# EasyEDA schematic PCB.json
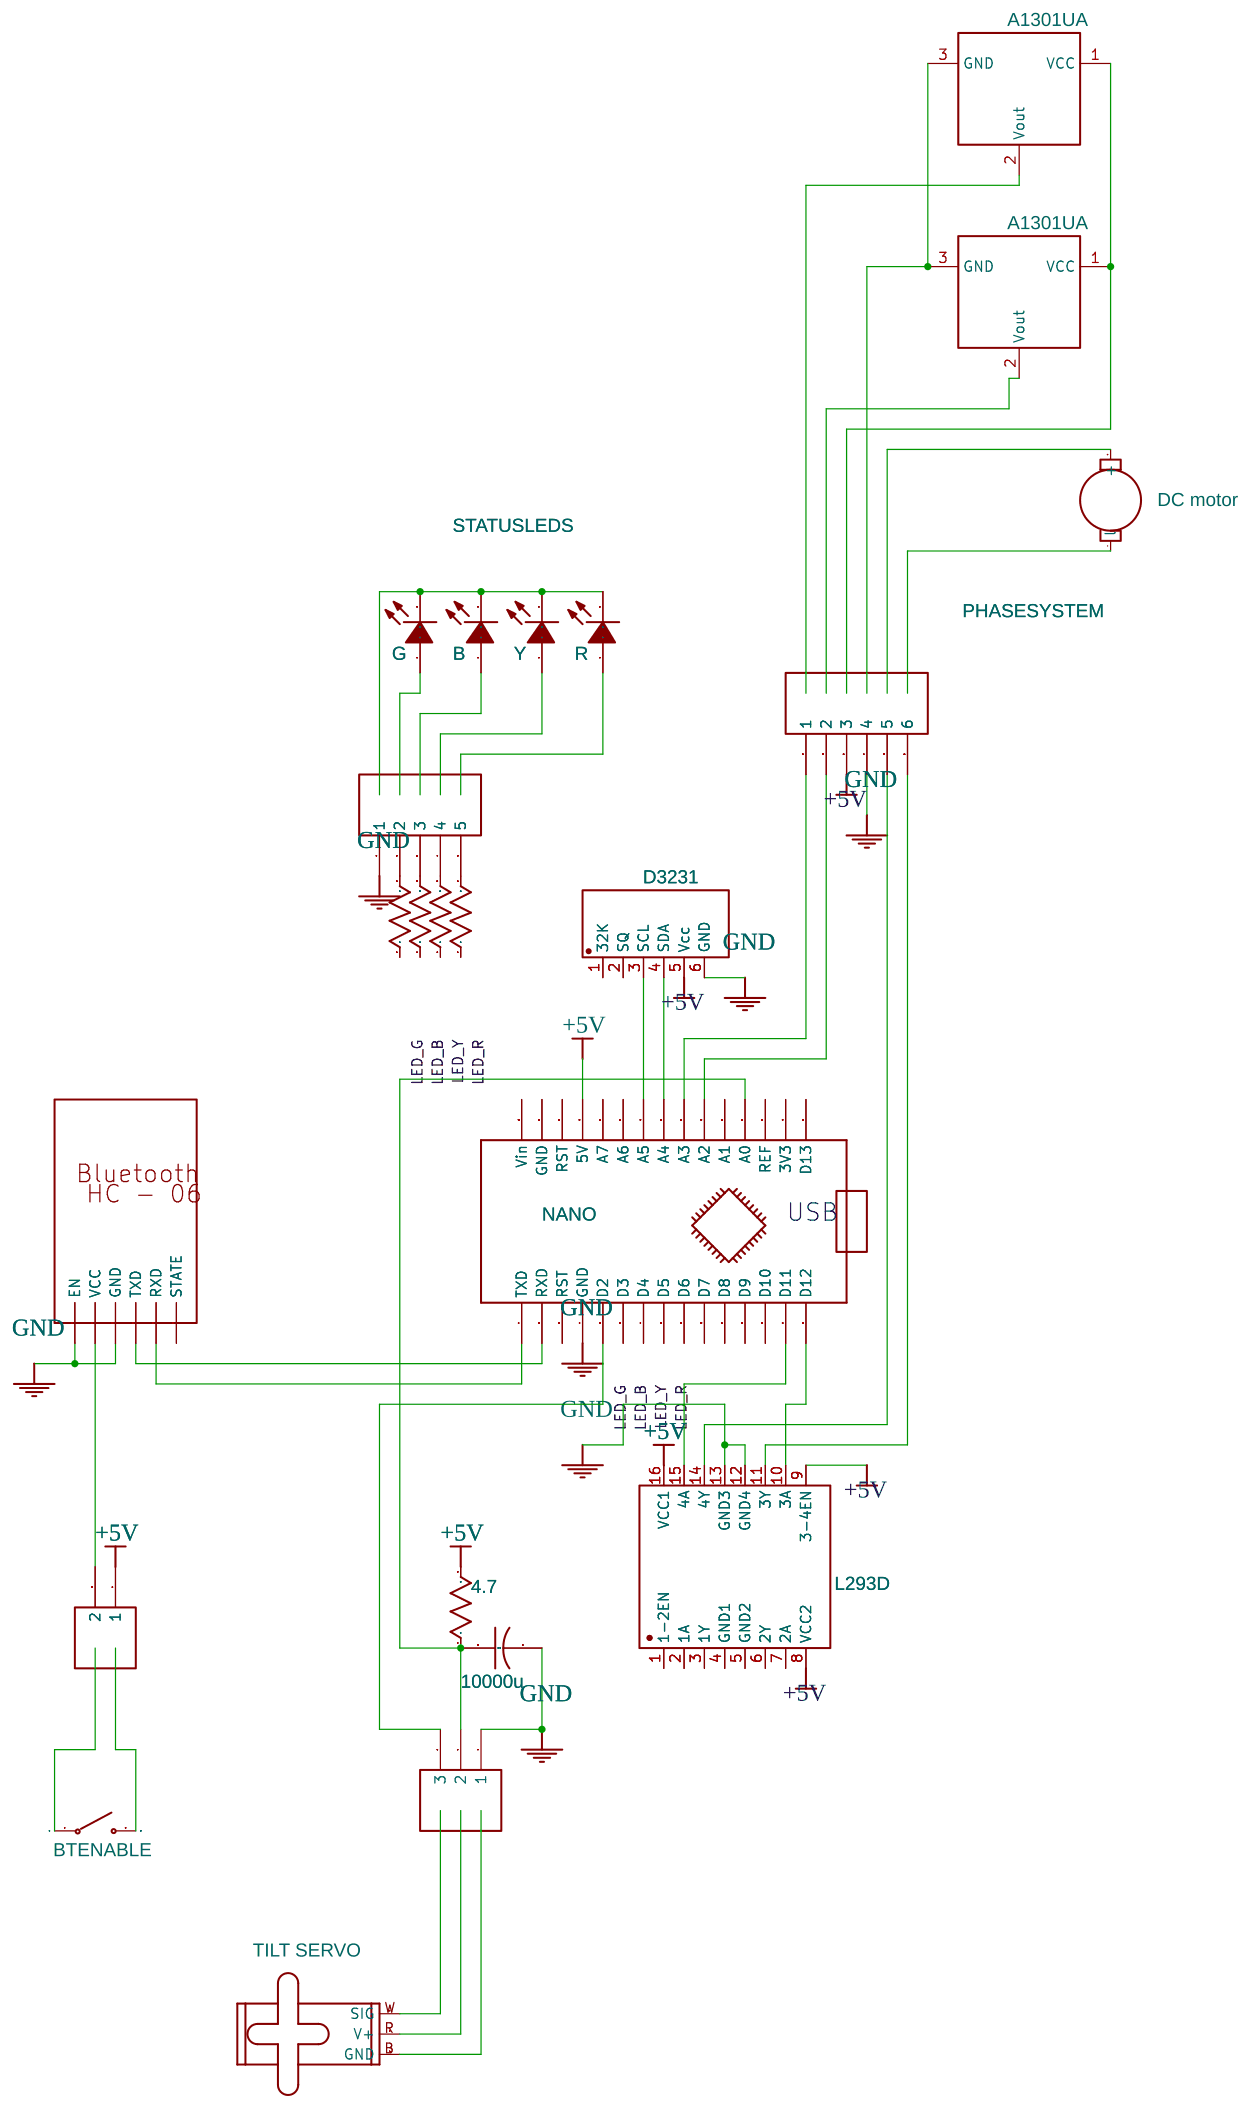
[diagram p0: schematic sheet]

## Parts
B  LED  [LED3MM]
BT  HC06  [HDR1X6]
BTENABLE  SPST_OFF  [TACTILE-PTH]
G  LED  [LED3MM]
M1  TILT SERVO  [1X03]
NANO  NO  [ARDUINO_NANO]
NO  SIP3  [HDR1X3]
NO#2  10000u  [CP_8X13MM]
NO#3  4.7  [R3]
NO#4  SIP2  [HDR1X2]
PHASESYSTEM  SIP6  [HDR1X6]
R  LED  [LED3MM]
R1  1k  [R3]
R2  1k  [R3]
R3  1k  [R3]
R4  1k  [R3]
STATUSLEDS  SIP5  [HDR1X5]
U1  D3231  [dip6]
U2  L293D  [DIP16]
U3  DC motor  [DIP]
U4  A1301UA
U5  A1301UA
Y  LED  [LED3MM]

## Library data of the parts
B G R Y = LED: Manufacturer Part: ?
BT = -: Contributor: frederic.vigreux; sourceId: j1ZXiEoK6; Manufacturer Part: ?
BTENABLE U1 = -: Manufacturer Part: ?
M1 = -: Small servo motor; catid: 20; Contributor: SparkFun; sourceId: E6dvNHZTb; Manufacturer Part: ?
NANO = -: catid: 20; sourceId: g2wyehQ7j; Manufacturer Part: ?
NO NO#4 PHASESYSTEM STATUSLEDS = -: catid: 20; Manufacturer Part: ?
NO#2 = Capacitor: Manufacturer Part: ?
NO#3 R1-R4 = Resistor: Manufacturer Part: ?
U2 = -: sourceId: DTpHZSasK; Manufacturer Part: ?
U3 = -: Contributor: danielagrell.1; sourceId: wa4YSasJ1; Manufacturer Part: ?
U4 U5 = -: catid: 20; Contributor: KiCad; sourceId: ww6ifBb9v; Manufacturer Part: ?

## Nets
+5V: NANO.27(5V) NO#3.2 NO#4.1 PHASESYSTEM.3 U1.5(Vcc) U2.8(VCC2) U2.9(3-4EN) U2.16(VCC1)
GND: BT.1(EN) BT.3(GND) NANO.4(GND) NO.1 NO#2.2 PHASESYSTEM.4 STATUSLEDS.1 U1.6(GND) U2.12(GND4) U2.13(GND3)
LED_R: NANO.14(A5) U1.3(SCL) U2.15(4A)
Net-(B-K): B.K G.K R.K Y.K
Net-(BT-2): BT.2(VCC) NO#4.2
Net-(BT-4): BT.4(TXD) NANO.2(RXD)
Net-(BT-5): BT.5(RXD) NANO.1(TXD)
Net-(NANO-5): NANO.5(D2) NO.3
Net-(NANO-12): NANO.12(A4) U1.4(SDA)
Net-(NANO-15): NANO.15(D12) U2.10(3A)
Net-(NANO-19): NANO.19(A0) NO.2 NO#2.1 NO#3.1
Net-(NANO-21): NANO.21(A2) PHASESYSTEM.2
Net-(NANO-22): NANO.22(A3) PHASESYSTEM.1
Net-(PHASESYSTEM-5): PHASESYSTEM.5 U2.14(4Y)
Net-(PHASESYSTEM-6): PHASESYSTEM.6 U2.11(3Y)
Net-(R1-2): R1.2 STATUSLEDS.5
Net-(R2-2): R2.2 STATUSLEDS.4
Net-(R3-2): R3.2 STATUSLEDS.3
Net-(R4-2): R4.2 STATUSLEDS.2
Net-(U4-1): U4.1(VCC) U5.1(VCC)
Net-(U4-3): U4.3(GND) U5.3(GND)

Not connected (* = marked no-connect by the designer): B A; BT 6(STATE); BTENABLE 1  2 ; G A; M1 1(SIG) 2(V+) 3(GND); NANO 3(RST) 6(D3) 7(D4) 8(D5) 9(D6) 10(D7) 11(D8) 13(D10) 16(D13) 17(3V3) 18(REF) 20(A1) 25(A6) 26(A7) 28(RST) 29(GND) 30(Vin); R A; R1 1; R2 1; R3 1; R4 1; U1 1(32K) 2(SQ); U2 1(1-2EN) 2(1A) 3(1Y) 4(GND1) 5(GND2) 6(2Y) 7(2A); U3 1(+) -(l); U4 2(Vout); U5 2(Vout); Y A

## Notes on the sheet
- USB
